# EAGLE design expander board rev1.1 (EAGLE 9.3.0)
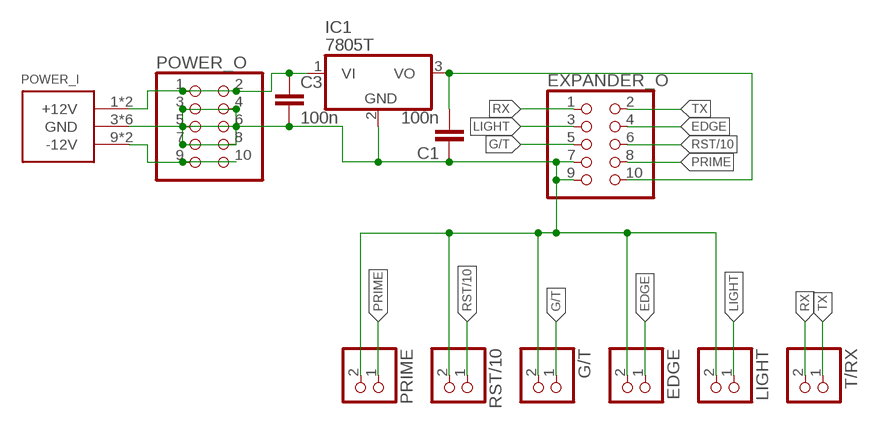
[diagram p0: schematic, sheet 1]

## Parts
C1  100n  C-EU025-025X050  [C025-025X050]
C3  100n  C-EU025-025X050  [C025-025X050]
EDGE  PINHD-1X2  [1X02]
EXPANDER_O  PINHD-2X5  [2X05]
G/T  PINHD-1X2  [1X02]
IC1  7805T  [TO220H]
LIGHT  PINHD-1X2  [1X02]
POWER_I  POWER_SIMPLE  [POWER_10_NSTRIPE]
POWER_O  PINHD-2X5  [2X05]
PRIME  PINHD-1X2  [1X02]
RST/10  PINHD-1X2  [1X02]
T/RX  PINHD-1X2  [1X02]

## Nets
+5V: C1.2 EXPANDER_O.10 IC1.3(VO)
+12V: C3.1 IC1.1(VI) POWER_I.1(+12V) POWER_I.2(+12V) POWER_O.1 POWER_O.2
-12V: POWER_I.9(-12V) POWER_I.10(-12V) POWER_O.9 POWER_O.10
EDGE: EDGE.1 EXPANDER_O.4
G/T: EXPANDER_O.5 G/T.1
GND: C1.1 C3.2 EDGE.2 EXPANDER_O.7 EXPANDER_O.9 G/T.2 IC1.2(GND) LIGHT.2 POWER_I.3(GND) POWER_I.4(GND) POWER_I.5(GND) POWER_I.6(GND) POWER_I.7(GND) POWER_I.8(GND) POWER_O.3 POWER_O.4 POWER_O.5 POWER_O.6 POWER_O.7 POWER_O.8 PRIME.2 RST/10.2
LIGHT: EXPANDER_O.3 LIGHT.1
PRIME: EXPANDER_O.8 PRIME.1
RST/10: EXPANDER_O.6 RST/10.1
RX: EXPANDER_O.1 T/RX.2
TX: EXPANDER_O.2 T/RX.1

## Library data of the parts
C1 C3 = resistor:C-EU: CAPACITOR, European symbol
EDGE G/T LIGHT PRIME RST/10 T/RX = pinhead:PINHD-1X2: PIN HEADER
EXPANDER_O POWER_O = pinhead:PINHD-2X5: PIN HEADER
IC1 = adafruit:78*: Positive VOLTAGE REGULATOR Added bigger pads to the TO-92 package
POWER_I = eurorack:POWER_SIMPLE

## Board
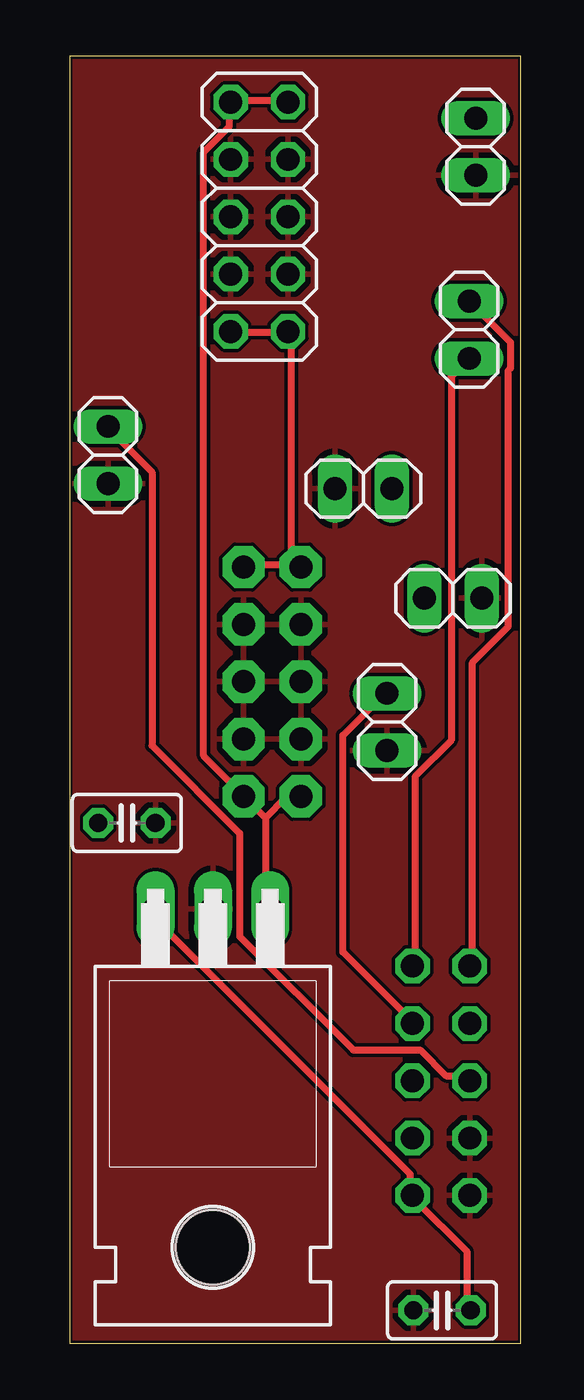
[diagram p1: board, top side]
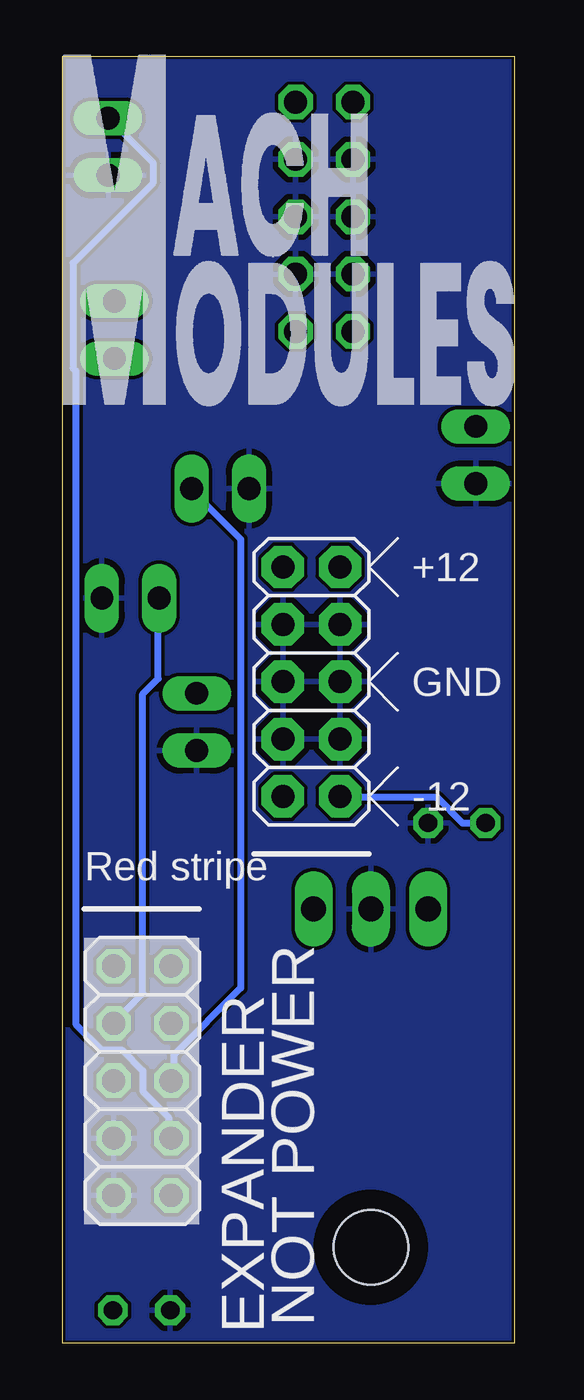
[diagram p2: board, bottom side, seen from below]

Size 20 x 57 mm. Coordinates in mm from the lower left corner, seen from the top.
Outline: 0,0 20,0 20,57 0,57 0,0
Copper layers (1*16): Top 0.035mm / dielectric 0.15mm / Bottom 0.035mm
Design rules "default *": minimum track width 12mil, minimum drill 0.35mm, track to track 6mil, track to pad 6mil, pad to pad 6mil, via to via 6mil, smd to smd 6mil, copper to edge 5mil, drill to drill 6mil, minimum pad ring 10mil, minimum via ring 8mil, stop-mask expansion 6mil, vias tented up to drill 14mil, thermal gap 10mil

### Footprints (pad centres in the part's own frame; a part is rotated, then mirrored left to right if it is on the bottom)
C025-025X050 = drill 0.813 octagon: 1 -1.27,0; 2 1.27,0
1X02 = drill 1.016 long: 1 -1.27,0; 2 1.27,0
2X05 = drill 1.016 octagon: 1 -5.08,-1.27; 2 -5.08,1.27; 3 -2.54,-1.27; 4 -2.54,1.27; 5 0,-1.27; 6 0,1.27; 7 2.54,-1.27; 8 2.54,1.27; 9 5.08,-1.27; 10 5.08,1.27
TO220H = drill 1.118 long: 1 -2.54,-10.16; 2 0,-10.16; 3 2.54,-10.16 | hole 3.302: 0,4.826
POWER_10_NSTRIPE = drill 1.016 pad 1.88 octagon: 1 -5.08,-1.27; 2 -5.08,1.27; 3 -2.54,-1.27; 4 -2.54,1.27; 5 0,-1.27; 6 0,1.27; 7 2.54,-1.27; 8 2.54,1.27; 9 5.08,-1.27; 10 5.08,1.27

### Placement (x,y rotation side)
C1  16.51,1.45 0 top
C3  2.54,23.04 0 top
EDGE  14.07,27.52 270 top
EXPANDER_O  16.47,11.62 270 bottom
G/T  1.7,39.34 270 top
IC1  6.35,9.07 180 top
LIGHT  17,33 0 top
POWER_I  8.98,29.3 90 bottom
POWER_O  8.41,49.9 270 top
PRIME  18,53 270 top
RST/10  13.02,37.86 180 top
T/RX  17.72,44.89 90 top

### Tracks (layer width: path | path; a pad name or v marks a point on that pad's centre or on a via)
+5V
  Top 0.305: IC1.3 3.89,19.15 3.89,18.7 15.09,7.5 15.09,6.58 EXPANDER_O.10 15.32,6.35 17.6,4.07 17.6,1.55 C1.2
+12V
  Top 0.305: POWER_O.2 9.6,55.04 7.32,55.04 POWER_O.1 7.09,54.81 7.09,53.9 5.94,52.76 5.94,26.01 7.54,24.41 POWER_I.1 7.77,24.18 8.69,23.27 | 8.69,23.27 8.69,19.38 IC1.1 | 8.69,23.27 9.6,24.18 10.06,24.18 POWER_I.2
  Bottom 0.305: C3.1 2.29,23.04 3.43,24.18 7.54,24.18 POWER_I.1
-12V
  Top 0.305: POWER_O.9 7.32,44.76 9.6,44.76 POWER_O.10 9.83,44.76 9.83,34.47 | 9.83,34.47 10.06,34.47 POWER_I.10 9.83,34.47 | 9.83,34.47 7.77,34.47 POWER_I.9
EDGE
  Top 0.305: EDGE.1 13.95,28.75 12.12,26.93 12.12,17.32 15.09,14.35 EXPANDER_O.4
G/T
  Top 0.305: EXPANDER_O.5 17.6,11.84 16.69,11.84 15.54,12.98 12.57,12.98 7.54,18.01 7.54,22.58 3.66,26.47 3.66,38.59 1.83,40.41 G/T.1
  Bottom 0.305: 1.91,40.19 1.65,40.56 1.6,40.64 G/T.1
GND
  pour Top: 0,57 0,0 20,0 20,57
  pour Bottom: 0,57 0,0 20,0 20,57
LIGHT
  Bottom 0.305: LIGHT.1 15.77,32.87 15.77,29.44 16.46,28.75 16.46,15.5 17.6,14.35 EXPANDER_O.3
PRIME
  Bottom 0.305: 17.81,54.13 17.97,54.3 18.06,54.36 PRIME.1 17.83,54.13 16,52.3 16,51.39 19.55,47.84 19.55,43.18 19.43,43.07 19.43,14.12 18.29,12.98 17.37,12.98 16.46,12.07 16.46,11.15 15.32,10.01 15.32,9.09 EXPANDER_O.8
RST/10
  Top 0.305: 14.4,37.9 RST/10.1
  Bottom 0.305: EXPANDER_O.6 15.09,11.84 15.09,12.75 12.12,15.72 12.12,35.61 14.17,37.67 RST/10.1
RX
  Top 0.305: EXPANDER_O.1 17.83,16.87 17.83,30.13 19.43,31.73 19.43,43.07 19.55,43.18 19.55,44.33 T/RX.2
TX
  Top 0.305: EXPANDER_O.2 15.32,16.87 15.32,25.1 16.92,26.7 16.92,42.82 T/RX.1

### Text on the board
bNames: Red stripe | POWER | EXPANDER | NOT